# Altium schematic sheet Power.SchDoc
size A4
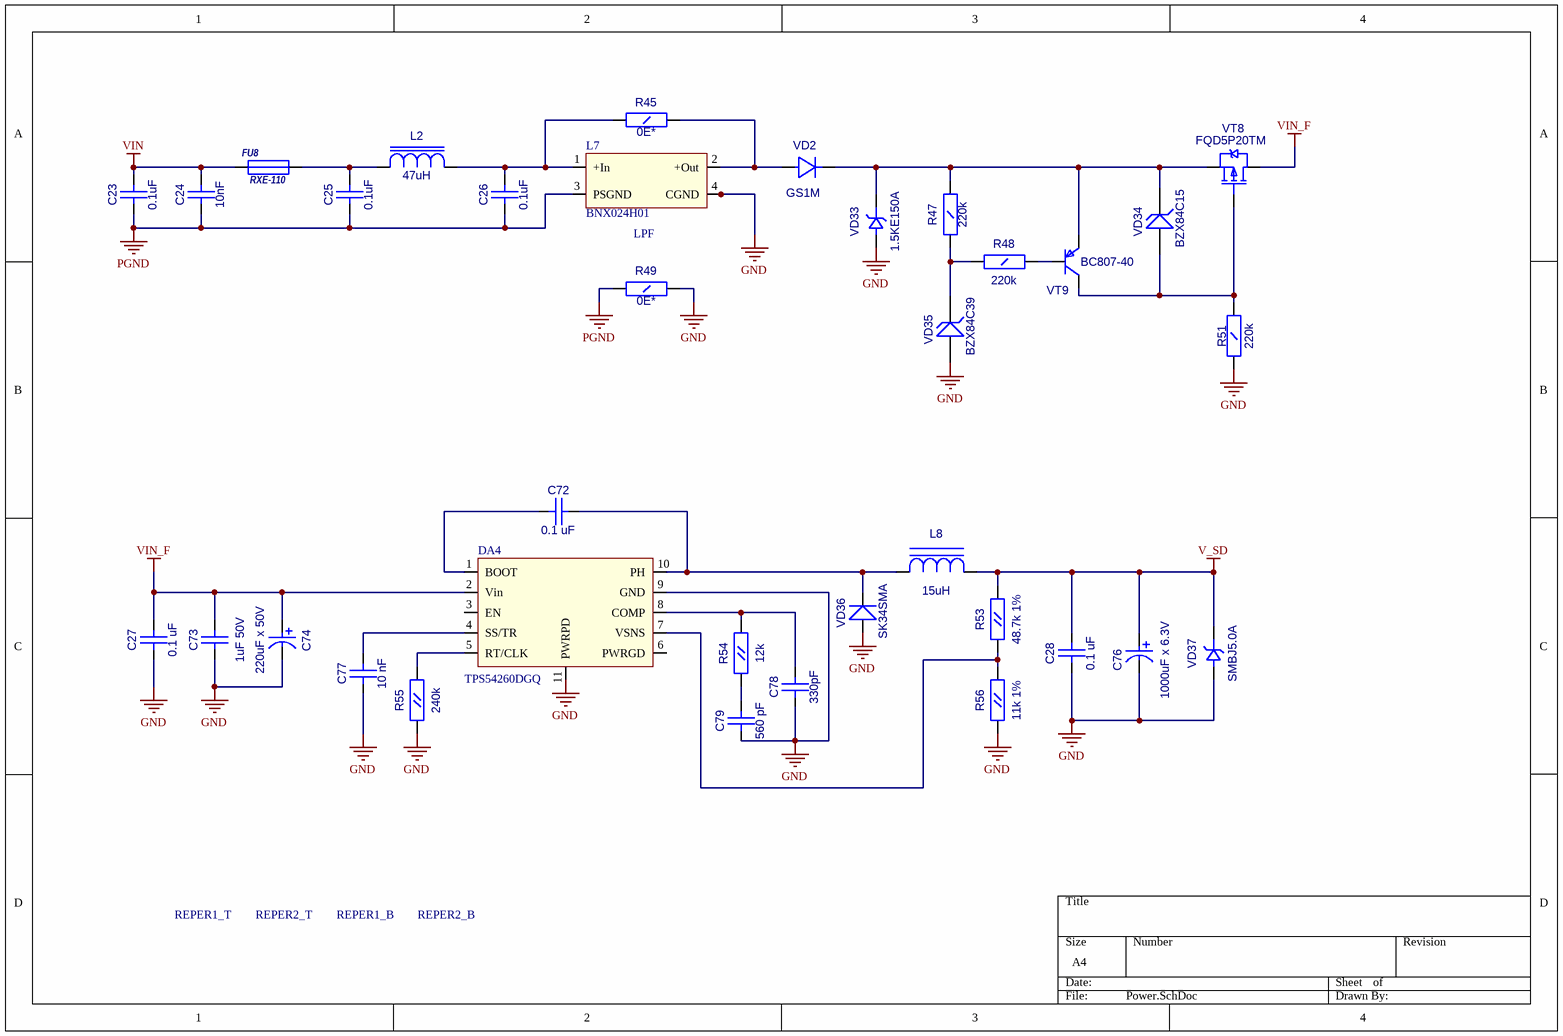
[diagram p0: Power.SchDoc]

## Parts
C23  0.1uF  [CC1206]
C24  10nF  [CC1206]
C25  0.1uF  [CC1206]
C26  0.1uF  [CC1206]
C27  0.1 uF  [CC0603]
C28  0.1 uF  [CC0603]
C72  0.1 uF  [CC0603]
C73  1uF 50V  [CC1206]
C74  220uF x 50V  [CC16X10_CAP0.5(1)(Primary)]
C76  1000uF x 6.3V  [CC16X10_CAP0.5(1)(Primary)]
C77  10 nF  [CC0603]
C78  330pF  [CC0603]
C79  560 pF  [CC0603]
DA4  TPS54260DGQ  [S-PDSO-G10]
FU8  RXE-110  [RXE-110]
L2  47uH  [SDR0603]
L7  BNX024H01  [BNX024]
L8  15uH  [SDR0805]
R45  0E*  [RC1206]
R47  220k  [RC1206]
R48  220k  [RC1206]
R49  0E*  [RC1206]
R51  220k  [RC1206]
R53  48.7k 1%  [RC0603]
R54  12k  [RC0603]
R55  240k  [RC0603]
R56  11k 1%  [RC0603]
REPER1_B  REPER1.2  [REPER1.2]  (value not drawn)
REPER1_T  REPER1.2  [REPER1.2]  (value not drawn)
REPER2_B  REPER1.2  [REPER1.2]  (value not drawn)
REPER2_T  REPER1.2  [REPER1.2]  (value not drawn)
VD2  GS1M  [SMA]
VD33  1.5KE150A  [DO-201]
VD34  BZX84C15  [SOT-23(123)]
VD35  BZX84C39  [SOT-23(123)]
VD36  SK34SMA  [SMA]
VD37  SMBJ5.0A  [SMB]
VT8  FQD5P20TM  [D-PAK(TO-252AA)]
VT9  BC807-40  [SOT-23(123)]

## Nets
GND: C27.1(A) C28.2(B) C73.1(A) C74.1 C76.1 C77.1(A) C78.1(A) C79.1(A) DA4.9(GND) DA4.11(PWRPD) L7.4(CGND) L7.5 L7.6 R49.2(B) R51.2(B) R55.1(A) R56.1(A) VD33.1(A) VD35.1(A) VD36.1(A) VD37.1(A)
PGND: C23.1(A) C24.1(A) C25.1(A) C26.1(A) L7.3(PSGND) R49.1(A)
V_SD: C28.1(A) C76.2 L8.2(A) R53.2(B) VD37.2(K)
VIN: C23.2(B) C24.2(B) FU8.1
VIN_F: C27.2(B) C73.2(B) C74.2 DA4.2(Vin) VT8.3(D)
NetC25_2: C25.2(B) FU8.2 L2.1
NetC26_2: C26.2(B) L2.2 L7.1(+In) R45.1(A)
NetC72_1: C72.1(A) DA4.1(BOOT)
NetC72_2: C72.2(B) DA4.10(PH) L8.1(C) VD36.2(K)
NetC77_2: C77.2(B) DA4.4(SS/TR)
NetC78_2: C78.2(B) DA4.8(COMP) R54.2(B)
NetC79_2: C79.2(B) R54.1(A)
NetDA4_5: DA4.5(RT/CLK) R55.2(B)
NetDA4_7: DA4.7(VSNS) R53.1(A) R56.2(B)
NetL7_2: L7.2(+Out) R45.2(B) VD2.1(A)
NetR47_1: R47.1(A) R48.1(A) VD35.3(K)
NetR47_2: R47.2(B) VD2.2(K) VD33.2(K) VD34.3(K) VT8.2(S) VT9.2(E)
NetR48_2: R48.2(B) VT9.1(B)
NetR51_1: R51.1(A) VD34.1(A) VT8.1(G) VT9.3(C)

Not connected (* = marked no-connect by the designer): DA4 3(EN) 6(PWRGD); REPER1_B 1; REPER1_T 1; REPER2_B 1; REPER2_T 1

## Notes on the sheet
- LPF

## Library data of the parts
C23-C26 C73 = CC1206
  C23 C25 C26: Value: 0.1uF
  C24: Value: 10nF
  C73: Value: 1uF 50V
C27 C28 C72 C77-C79 = CC0603
  C27 C28 C72: Value: 0.1 uF
  C77: Value: 10 nF
  C78: Value: 330pF
  C79: Value: 560 pF
C74 C76 = CAP0.5(1)
  C74: Value: 220uF x 50V
  C76: Value: 1000uF x 6.3V
L2 = SDR0603: Value: 47uH
L7 = BNX024H01: LC Filter
L8 = SDR0805: Value: 15uH
R45 R47-R49 R51 = RC1206
  R45 R49: Value: 0E*
  R47 R48 R51: Value: 220k
R53-R56 = RC0603
  R53: Value: 48.7k 1%
  R54: Value: 12k
  R55: Value: 240k
  R56: Value: 11k 1%
VD2 = GS1M: Value: {Value}
VD33 = 1.5KE: Value: 1.5KE150A
VD34 VD35 = BZX84: Zener Voltage Regulator Diode; Value: {Value}
VD36 = SK34SMA: Schottky Rectifier; Value: {Value}
VD37 = SMBJ: Value: *
VT8 = IRFR9220: HEXFET Power MOSFET; OriginalName: IRLML5103; ComponentField7: Published 8-Jun-2000; Value: FQD5P20TM
VT9 = BC857B: OriginalName: BC846BLT1; ComponentField7: Published 29-Sep-2000; Value: BC807-40
FU8 = RXE-110: Value: *
REPER1_B REPER1_T REPER2_B REPER2_T = REPER1.2: Value: *